# EAGLE design HIH6130_Breakout (EAGLE 6.4)
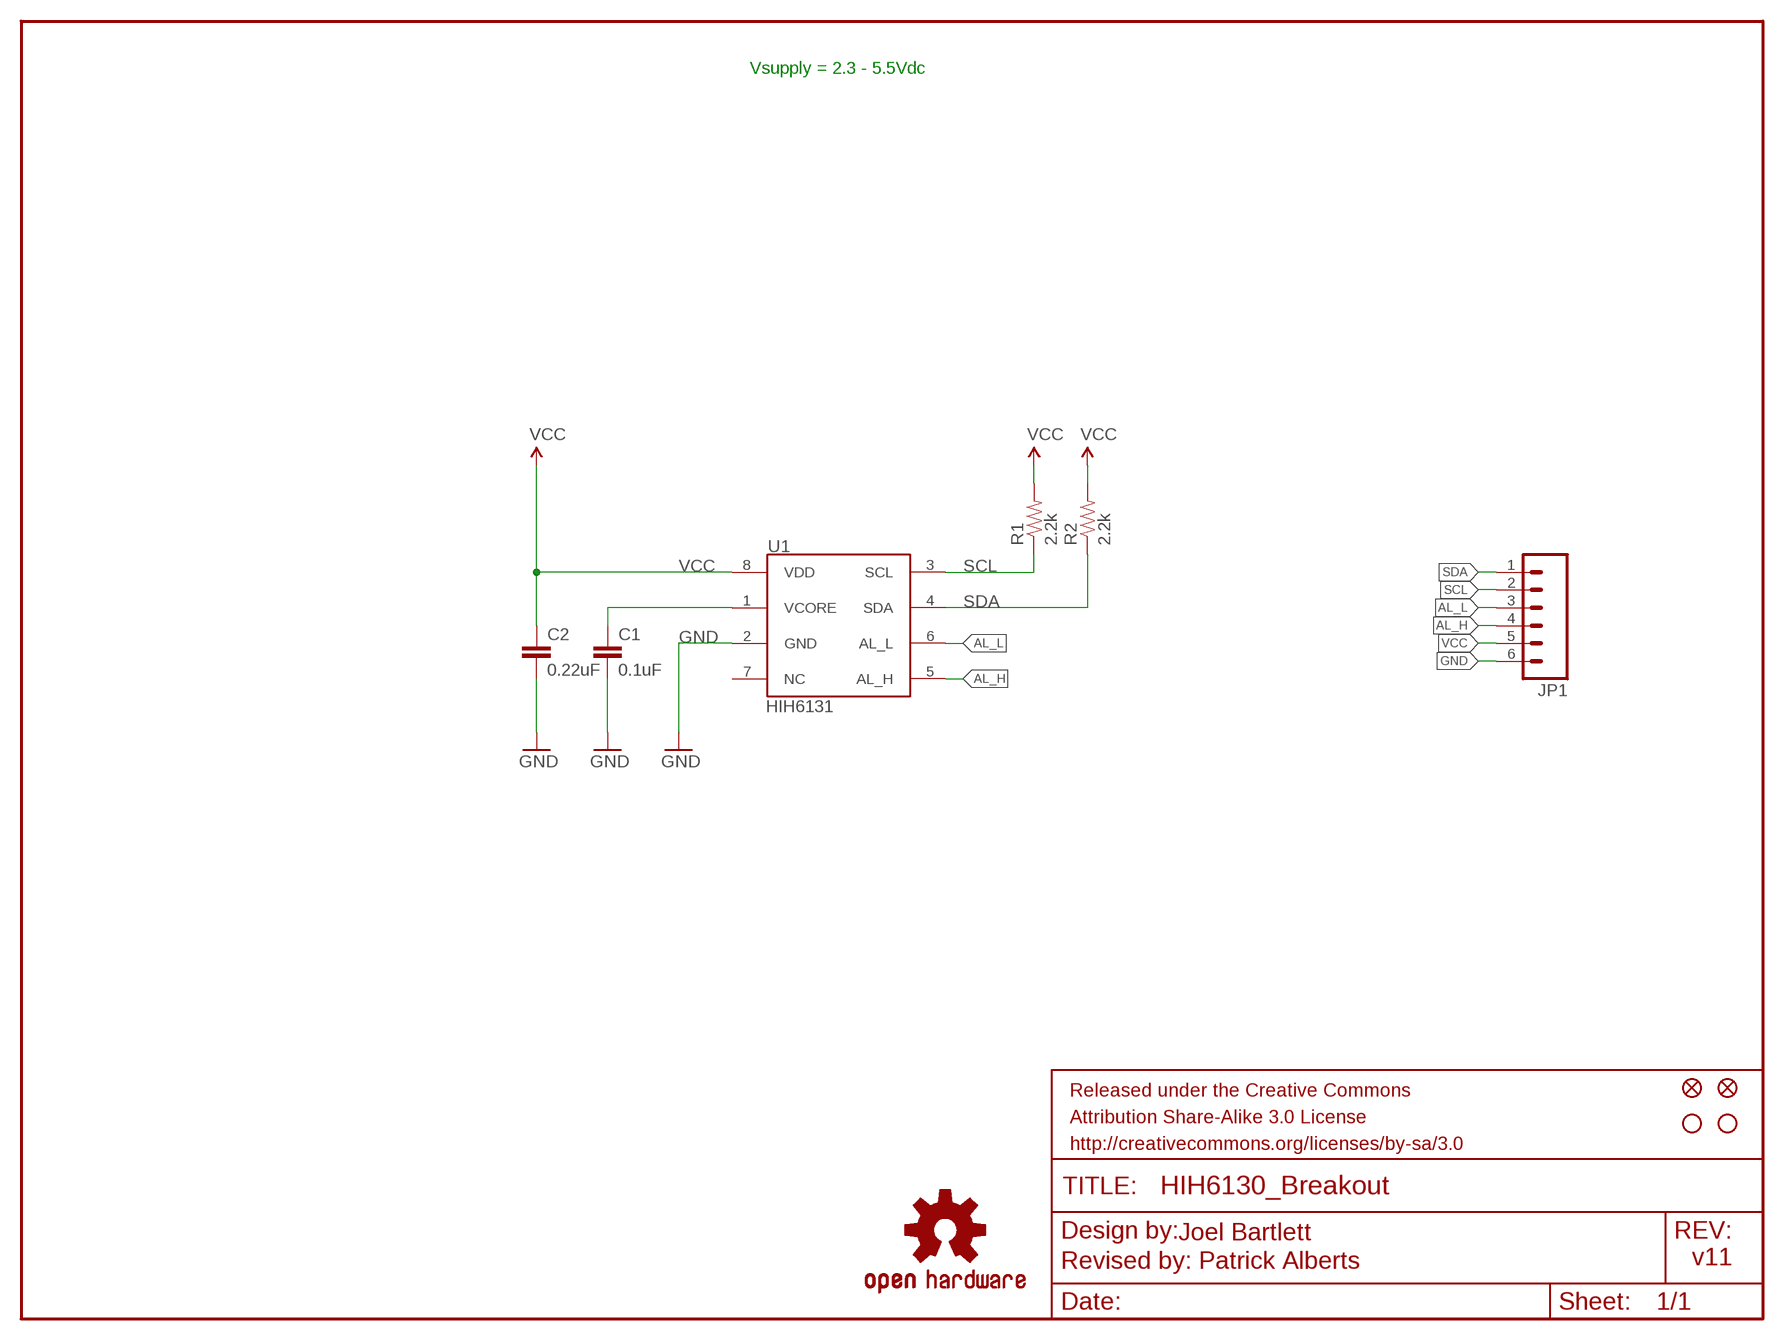
[diagram p0: schematic, sheet 1]

## Parts
C1  0.1uF  0.1UF-25V(+80/-20%)(0603)  [0603-CAP]
C2  0.22uF  0.22UF-25V-10%(0603)  [0603-CAP]
FRAME1  FRAME-LETTER  [CREATIVE_COMMONS]
JP1  M06SIP  [1X06]
JP2  FIDUCIALUFIDUCIAL  [MICRO-FIDUCIAL]
JP3  STAND-OFFTIGHT  [STAND-OFF-TIGHT]
JP4  STAND-OFFTIGHT  [STAND-OFF-TIGHT]
JP5  FIDUCIALUFIDUCIAL  [MICRO-FIDUCIAL]
R1  2.2k  2.2KOHM1/10W1%(0603)  [0603-RES]
R2  2.2k  2.2KOHM1/10W1%(0603)  [0603-RES]
U1  HIH6131  [SOIC8]
U$2  OSHW-LOGOS  [OSHW-LOGO-S]

## Nets
AL_H: JP1.4 U1.5(AL_H)
AL_L: JP1.3 U1.6(AL_L)
GND: C1.2 C2.2 JP1.6 U1.2(GND)
N$1: C1.1 U1.1(VCORE)
SCL: JP1.2 R1.1 U1.3(SCL)
SDA: JP1.1 R2.1 U1.4(SDA)
VCC: C2.1 JP1.5 R1.2 R2.2 U1.8(VDD)
Unconnected: U1.7(NC)

## Notes on the sheet
- Vsupply = 2.3 - 5.5Vdc
- Joel Bartlett
- Revised by: Patrick Alberts | v11

## Library data of the parts
C1 = SparkFun-Capacitors:0.1UF-25V(+80/-20%)(0603): CAP-00810 Ceramic Standard decoupling cap; PROD_ID: CAP-00810
C2 = SparkFun-Capacitors:0.22UF-25V-10%(0603): CAP-07822; PROD_ID: CAP-07822
FRAME1 = SparkFun-Aesthetics:FRAME-LETTER: Schematic Frame Standard 8.5x11 US Letter frame
JP1 = SparkFun:M06: Header 6 Standard 6-pin 0.1" header. Use with straight break away headers (SKU : PRT-00116), right angle break away headers (PRT-00553), swiss pins (PRT-00743), machine pins (PRT-00117), and female headers (PRT-00115). Molex polarized connector foot print use with SKU : PRT-08094 with associated crimp pins and housings. NOTES ON THE VARIANTS LOCK and LOCK_LONGPADS... This footprint was designed to help hold the alignment of a through-hole component (i.e. 6-pin header) while soldering it into place. You may notice that each hole has been shifted either up or down by 0.005 of an inch from it's more standard position (which is a perfectly straight line). This slight alteration caused the pins (the squares in the middle) to touch the edges of the holes. Because they are alternating, it causes a "brace" to hold the component in place. 0.005 has proven to be the perfect amount of "off-center" position when using our standard breakaway headers. Although looks a little odd when you look at the bare footprint, once you have a header in there, the alteration is very hard to notice. Also, if you push a header all the way into place, it is covered up entirely on the bottom side. This idea of altering the position of holes to aid alignment will be further integrated into the Sparkfun Library for other footprints. It can help hold any component with 3 or more connection pins.
JP2 JP5 = SparkFun:FIDUCIAL: Fiducial Alignment Points Various fiducial points for machine vision alignment.
JP3 JP4 = SparkFun:STAND-OFF: Stand Off This is the mechanical footprint for a #4 phillips button head screw. Use the keepout ring to avoid running the screw head into surrounding components. SKU : PRT-00447
R1 R2 = SparkFun-Resistors:2.2KOHM1/10W1%(0603): RES-08272; PROD_ID: RES-08272
U1 = SparkFun:HIH6131
U$2 = SparkFun:OSHW-LOGO: Open Source Hardware Logo This logo indicates the piece of hardware it is found on incorporates a OSHW license and/or adheres to the definition of open source hardware found here: http://freedomdefined.org/OSHW

## Net classes
0 Default: width 0.203 mm
1 vcc: width 0.254 mm
2 GND: width 0.813 mm

## Board
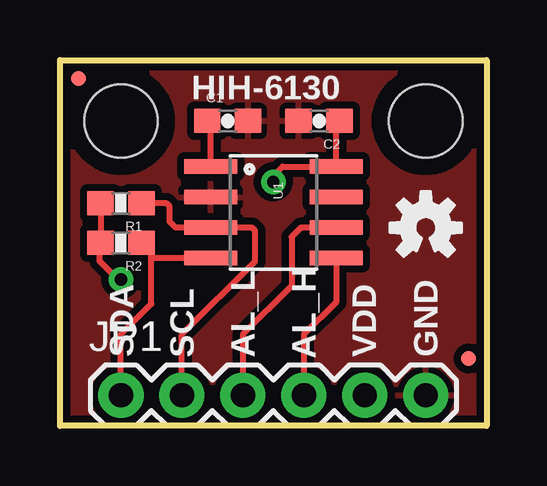
[diagram p1: board, top side]
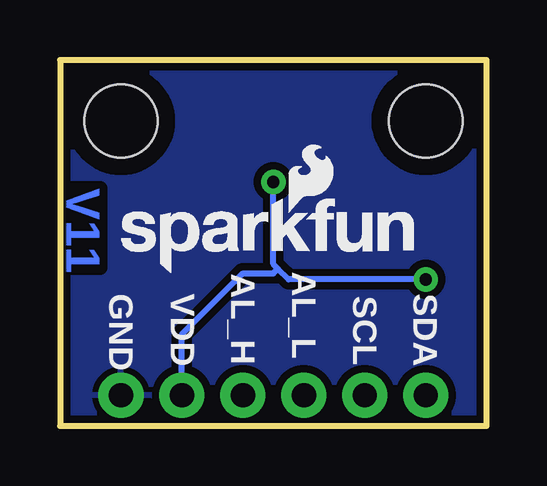
[diagram p2: board, bottom side, seen from below]

Size 17.78 x 15.24 mm. Coordinates in mm from the lower left corner, seen from the top.
Outline: 0,0 0,15.24 17.78,15.24 17.78,0 0,0
Copper layers (1*16): Top 0.035mm / dielectric 1.5mm / Bottom 0.035mm
Design rules "SparkFun": minimum track width 8mil, minimum drill 20mil, track to track 8mil, track to pad 8mil, pad to pad 8mil, via to via 8mil, smd to smd 8mil, copper to edge 8mil, drill to drill 8mil, minimum pad ring 12mil, minimum via ring 10mil, stop-mask expansion 4mil, vias tented up to drill 20mil, thermal gap 10mil

### Footprints (pad centres in the part's own frame; a part is rotated, then mirrored left to right if it is on the bottom)
0603-CAP = smd 1.1 x 1: 1 -0.85,0; 2 0.85,0
1X06 = drill 1.016 pad 1.88: 1 0,0; 2 2.54,0; 3 5.08,0; 4 7.62,0; 5 10.16,0; 6 12.7,0
MICRO-FIDUCIAL = smd 0.635 x 0.635: 1 0,0
STAND-OFF-TIGHT = hole 3.048: 0,0
0603-RES = smd 1.1 x 1: 1 -0.85,0; 2 0.85,0
SOIC8 = smd 0.61 x 2.21: 1 -1.905,-2.616; 2 -0.635,-2.616; 3 0.635,-2.616; 4 1.905,-2.616; 5 1.905,2.616; 6 0.635,2.616; 7 -0.635,2.616; 8 -1.905,2.616

### Placement (x,y rotation side)
C1  6.99,12.7 0 top
C2  10.79,12.7 180 top
FRAME1  -104.63,0 0 top  (outside the outline)
JP1  2.54,1.27 0 top
JP2  17.02,2.79 0 top
JP3  2.54,12.7 0 top
JP4  15.24,12.7 0 top
JP5  0.76,14.48 0 top
R1  2.54,9.27 180 top
R2  2.54,7.62 180 top
U1  8.89,8.89 270 top
U$1  [SFE-NEW-WEB-SOLDERMASK]  15.24,6.35 0 bottom
U$2  15.24,8.26 0 top
U$3  [SFE-LOGO-FLAME]  8.26,8.89 0 bottom
U$6  [SFE-NEW-WEB-SOLDERMASK]  15.24,6.35 0 bottom
U$7  [SFE-NEW-WEB-SOLDERMASK]  15.24,6.35 0 bottom
U$8  [SFE-NEW-WEB]  15.24,6.35 0 bottom

### Tracks (layer width: path | path; a pad name or v marks a point on that pad's centre or on a via)
AL_H
  Top 0.254: U1.5 11.51,5.16 10.16,3.81 JP1.4
AL_L
  Top 0.254: U1.6 10.03,8.26 9.65,7.87 9.65,5.84 7.62,3.81 JP1.3
GND
  pour Bottom (isolate 0.305): 0,15.24 0,0 17.78,0 17.78,15.24
  pour Top (isolate 0.305): 0,15.24 0,0 17.78,0 17.78,15.24
N$1
  Top 0.254: U1.1 6.27,12.62 6.35,12.7 C1.1
SCL
  Top 0.254: R1.1 4.45,9.27 4.57,9.14 4.57,8.51 4.83,8.26 U1.3 8,8.26 8.13,8.13 8.13,6.86 5.08,3.81 JP1.2
SDA
  Top 0.254: JP1.1 2.54,3.81 3.81,5.08 3.81,6.99 | R2.1 3.81,7.2 3.81,6.99 | U1.4 3.81,6.99
VCC  (via drill 0.51)
  Top 0.254: 11.51,12.62 11.43,12.7 C2.1 11.51,12.56 U1.8 9.27,10.79 8.89,10.41 v8.89,10.16 | 1.89,7.42 R2.2 | R1.2 R2.2 | v2.54,6.1 2.41,6.1 1.65,6.86 1.65,7.58 R2.2
  Bottom 0.254: v2.54,6.1 8.26,6.1 8.7,6.54 | 8.7,6.54 8.89,6.73 v8.89,10.16 | JP1.5 12.7,3.81 10.16,6.35 8.89,6.35 8.7,6.54

### Text on the board
Bottom: V11
tPlace: HIH-6130 | SDA | SCL | AL_L | AL_H | VDD | GND
bPlace: SDA | AL_L | AL_H | VDD | GND | SCL
tDocu: Joel Bartlett | Revised by: Patrick Alberts